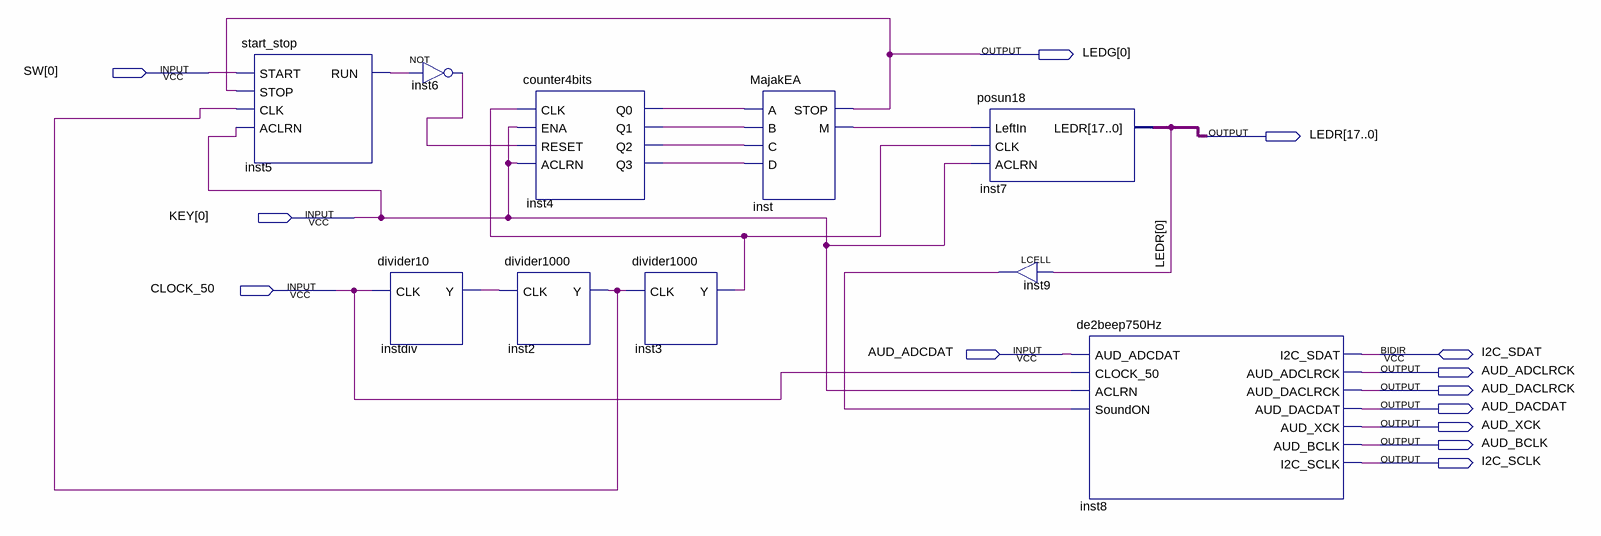
[diagram p0: schematic sheet]
// Quartus schematic NovaBlob.bdf as structural Verilog: 10 symbols, 13 pins
module NovaBlob (
  input  [0:0] SW,
  input  [0:0] KEY,
  input  CLOCK_50,
  input  AUD_ADCDAT,
  inout  I2C_SDAT,
  output [0:0] LEDG,
  output [17:0] LEDR,
  output AUD_ADCLRCK,
  output AUD_DACLRCK,
  output AUD_DACDAT,
  output AUD_XCK,
  output AUD_BCLK,
  output I2C_SCLK
);

  wire inst2_y, inst3_y, inst4_q0, inst4_q1, inst4_q2, inst4_q3, inst5_run, inst6_out, inst9_out, inst_m,
       instdiv_y;

  start_stop inst5 (.START(SW[0]), .STOP(LEDG[0]), .CLK(inst2_y), .ACLRN(KEY[0]), .RUN(inst5_run));
  divider10 instdiv (.CLK(CLOCK_50), .Y(instdiv_y));
  not inst6 (inst6_out, inst5_run);
  counter4bits inst4 (
    .CLK(inst3_y), .ENA(KEY[0]), .RESET(inst6_out), .ACLRN(KEY[0]), .Q0(inst4_q0), .Q1(inst4_q1),
    .Q2(inst4_q2), .Q3(inst4_q3));
  divider1000 inst2 (.CLK(instdiv_y), .Y(inst2_y));
  divider1000 inst3 (.CLK(inst2_y), .Y(inst3_y));
  MajakEA inst (.A(inst4_q0), .B(inst4_q1), .C(inst4_q2), .D(inst4_q3), .STOP(LEDG[0]), .M(inst_m));
  posun18 inst7 (.LeftIn(inst_m), .CLK(inst3_y), .ACLRN(KEY[0]), .LEDR(LEDR));
  LCELL inst9 (.IN(LEDR[0]), .OUT(inst9_out));
  de2beep750Hz inst8 (
    .AUD_ADCDAT(AUD_ADCDAT), .CLOCK_50(CLOCK_50), .ACLRN(KEY[0]), .SoundON(inst9_out),
    .AUD_ADCLRCK(AUD_ADCLRCK), .AUD_DACLRCK(AUD_DACLRCK), .AUD_DACDAT(AUD_DACDAT), .AUD_XCK(AUD_XCK),
    .AUD_BCLK(AUD_BCLK), .I2C_SCLK(I2C_SCLK), .I2C_SDAT(I2C_SDAT));
endmodule
